# EAGLE design RelayTest (EAGLE 9.0.1)
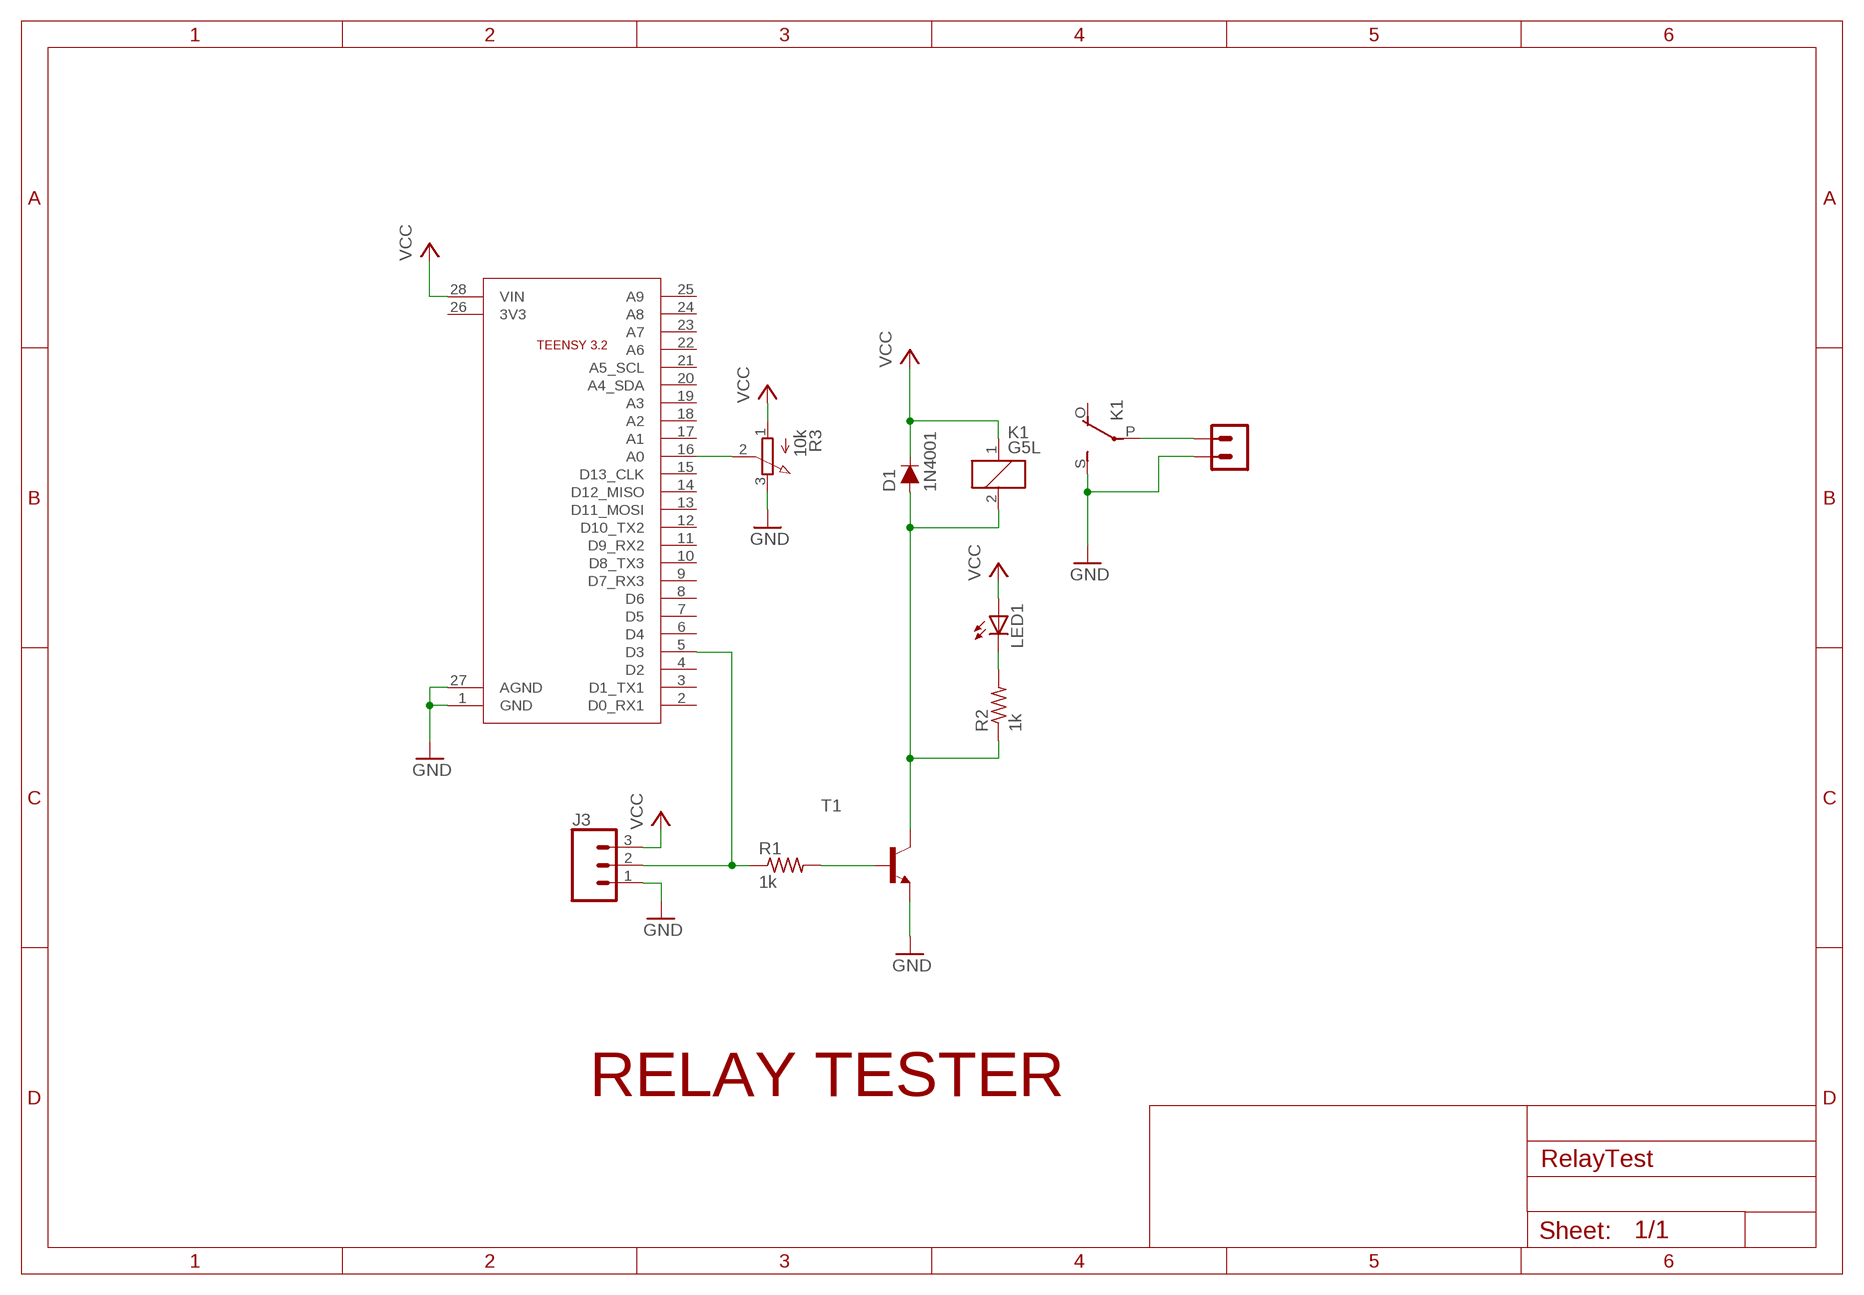
[diagram p0: schematic, sheet 1]

## Parts
D1  1N4001  DIODE-KIT2  [DIODE-1N4001-KIT]
J3  CONN_03SCREW  [SCREWTERMINAL-3.5MM-3]
K1  G5L  [G5LE]
LED1  LED3MM  [LED3MM]
R1  1k  R-US_0204/7  [0204/7]
R2  1k  R-US_0204/7  [0204/7]
R3  10k  3RP/1610N  [3RP/1610N]
T1  -NPN-TO92-EBC  [TO92-EBC]
U$1  TEENSY3.2  [TEENSY]
U$2  BIG_TERMINAL_2PINBIG  [BIG_TERMINAL_2PIN]

## Nets
GND: J3.1 K1.S(2:S) R3.3(E) T1.E U$1.1(GND) U$1.27(AGND) U$2.P$2
N$1: LED1.K(C) R2.2
N$2: R1.2 T1.B
N$3: J3.2 R1.1 U$1.5(D3)
N$4: R3.2(S) U$1.16(A0)
N$7: D1.A K1.2 R2.1 T1.C
N$10: K1.P(2:P) U$2.P$1
VCC: D1.C J3.3 K1.1 LED1.A R3.1(A) U$1.28(VIN)
Unconnected: K1.O(2:O) U$1.2(D0_RX1) U$1.3(D1_TX1) U$1.4(D2) U$1.6(D4) U$1.7(D5) U$1.8(D6) U$1.9(D7_RX3) U$1.10(D8_TX3) U$1.11(D9_RX2) U$1.12(D10_TX2) U$1.13(D11_MOSI) U$1.14(D12_MISO) U$1.15(D13_CLK) U$1.17(A1) U$1.18(A2) U$1.19(A3) U$1.20(A4_SDA) U$1.21(A5_SCL) U$1.22(A6) U$1.23(A7) U$1.24(A8) U$1.25(A9) U$1.26(3V3)

## Notes on the sheet
- RELAY TESTER

## Library data of the parts
D1 = SparkFun-DiscreteSemi:DIODE: Diode These are standard reverse protection diodes and small signal diodes. SparkFun Products: SparkFun SparkPunk Sound Kit <https://www.sparkfun.com/products/11177> SparkFun ESP8266 Thing <https://www.sparkfun.com/products/13231>; PROD_ID: DIO-09176; VALUE: 1A/50V/1.1V
J3 = SparkFun-Connectors:CONN_03: Multi connection point. Often used as Generic Header-pin footprint for 0.1 inch spaced/style header connections On any of the 0.1 inch spaced packages, you can populate with these: Break Away Headers - Straight <https://www.sparkfun.com/products/116> (PRT-00116) Break Away Male Headers - Right Angle <https://www.sparkfun.com/products/553> (PRT-00553) Female Headers <https://www.sparkfun.com/products/115> (PRT-00115) Break Away Headers - Machine Pin <https://www.sparkfun.com/products/117> (PRT-00117) Break Away Female Headers - Swiss Machine Pin <https://www.sparkfun.com/products/743> (PRT-00743) Stackable Header - 3 Pin (Female, 0.1") <https://www.sparkfun.com/products/13875> (PRT-13875) For SCREWTERMINALS and SPRING TERMINALS visit here: Screw Terimnals on SparkFun.com <https://www.sparkfun.com/search/results?term=Screw+Terminals> (5mm/3.5mm/2.54mm spacing) This device is also useful as a general connection point to wire up your design to another part of your project. Our various solder wires solder well into these plated through hole pads. Hook-Up Wire - Assortment (Stranded, 22 AWG) <https://www.sparkfun.com/products/11375> (PRT-11375) Hook-Up Wire - Assortment (Solid Core, 22 AWG) <https://www.sparkfun.com/products/11367> (PRT-11367) View the entire wire category on our website here <https://www.sparkfun.com/categories/141> Special notes: Molex polarized connector foot print use with SKU : PRT-08232 with associated crimp pins and housings.; PROD_ID: CONN-08288; SF_ID: PRT-08235
K1 = relay:G5L: RELAY 1 x switch, 10 A/120 V AC, 8 A/30 V ADC, Omron; OC_FARNELL: unknown; OC_NEWARK: unknown
LED1 = adafruit:LED: LED OSRAM: - CHIPLED LG R971, LG N971, LY N971, LG Q971, LY Q971, LO R971, LY R971 LH N974, LH R974 LS Q976, LO Q976, LY Q976 LO Q996 - Hyper CHIPLED LW Q18S LB Q993, LB Q99A, LB R99A - SideLED LS A670, LO A670, LY A670, LG A670, LP A670 LB A673, LV A673, LT A673, LW A673 LH A674 LY A675 LS A676, LA A676, LO A676, LY A676, LW A676 LS A679, LY A679, LG A679 - Hyper Micro SIDELED® LS Y876, LA Y876, LO Y876, LY Y876 LT Y87S - SmartLED LW L88C, LW L88S LB L89C, LB L89S, LG L890 LS L89K, LO L89K, LY L89K LS L896, LA L896, LO L896, LY L896 - TOPLED LS T670, LO T670, LY T670, LG T670, LP T670 LSG T670, LSP T670, LSY T670, LOP T670, LYG T670 LG T671, LOG T671, LSG T671 LB T673, LV T673, LT T673, LW T673 LH T674 LS T676, LA T676, LO T676, LY T676, LB T676, LH T676, LSB T676, LW T676 LB T67C, LV T67C, LT T67C, LS T67K, LO T67K, LY T67K, LW E67C LS E67B, LA E67B, LO E67B, LY E67B, LB E67C, LV E67C, LT E67C LW T67C LS T679, LY T679, LG T679 LS T770, LO T770, LY T770, LG T770, LP T770 LB T773, LV T773, LT T773, LW T773 LH T774 LS E675, LA E675, LY E675, LS T675 LS T776, LA T776, LO T776, LY T776, LB T776 LHGB T686 LT T68C, LB T68C - Hyper Mini TOPLED® LB M676 - Mini TOPLED Santana® LG M470 LS M47K, LO M47K, LY M47K Source: http://www.osram.convergy.de/
R1 R2 = rcl:R-US_: RESISTOR, American symbol; SPICEPREFIX: R
R3 = pot:3RP/1610N: 16mm Potentiometer one level Source: http://www.alphapotentiometers.net/html/16mm_pot_2.html
T1 = DC_LOAD_AU:*-NPN-: NPN Transistror BF959 corrected 2008.03.06
U$1 = EzerLonginus:TEENSY
U$2 = EzerLonginus:BIG_TERMINAL_2PIN

## Board
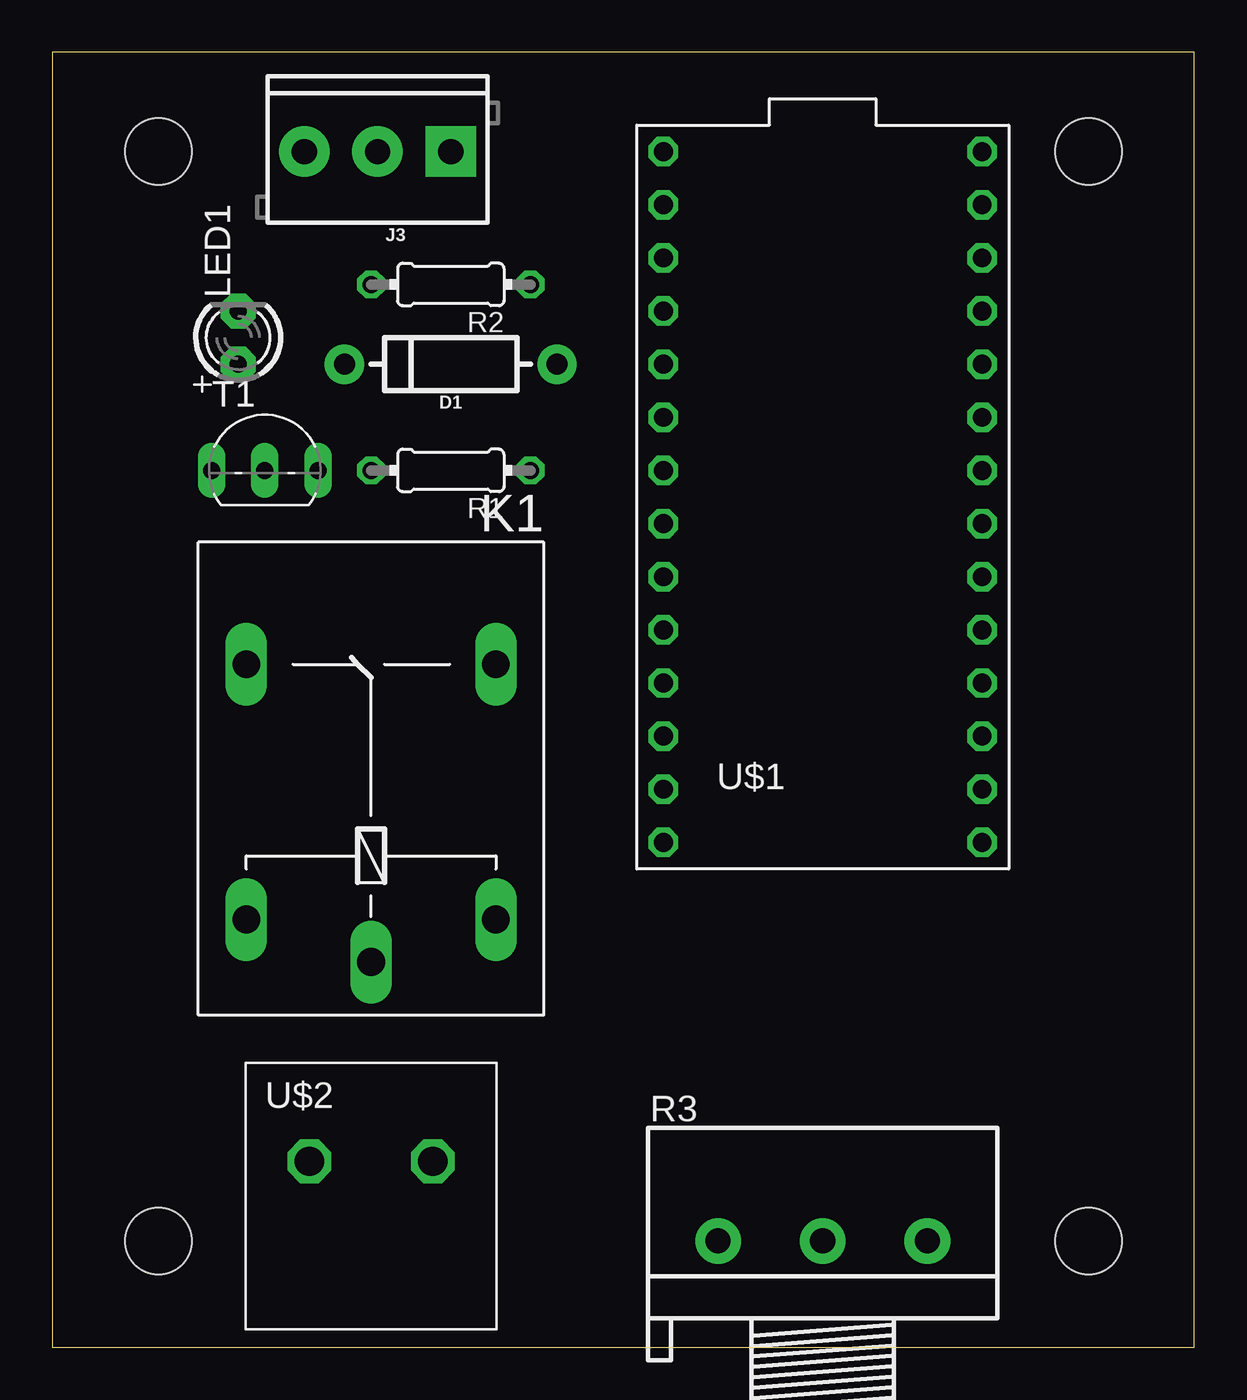
[diagram p1: board, top side]
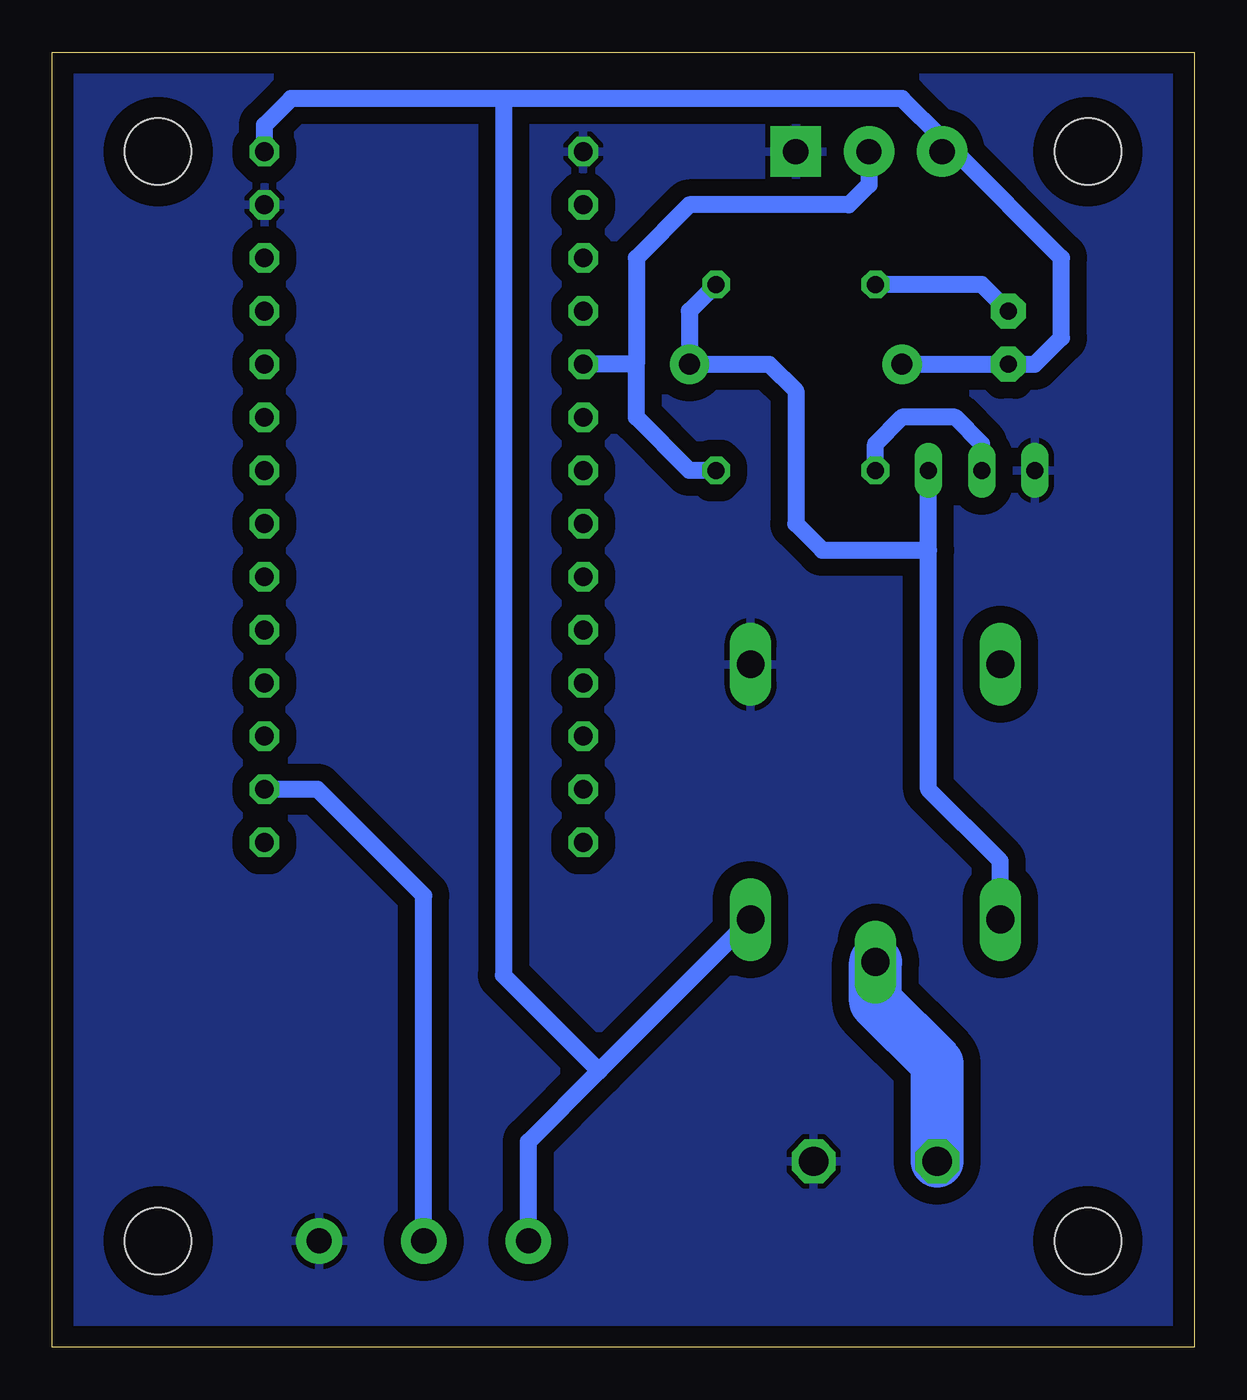
[diagram p2: board, bottom side, seen from below]

Size 54.59 x 61.9 mm. Coordinates in mm from the lower left corner, seen from the top.
Outline: 0,0 54.59,0 54.59,61.9 0,61.9 0,0
Copper layers (1*16): Top 0.035mm / dielectric 1.5mm / Bottom 0.035mm
Design rules "default": minimum track width 6mil, minimum drill 0.35mm, track to track 6mil, track to pad 6mil, pad to pad 6mil, via to via 6mil, smd to smd 6mil, copper to edge 40mil, drill to drill 6mil, minimum pad ring 10mil, minimum via ring 8mil, stop-mask expansion 4mil, vias tented up to drill 0mil, thermal gap 10mil
Holes 3.17 mm at 5.08,57.15 5.08,5.08 49.53,5.08 49.53,57.15

### Footprints (pad centres in the part's own frame; a part is rotated, then mirrored left to right if it is on the bottom)
DIODE-1N4001-KIT = drill 1.016 pad 1.88: A -5.08,0; C 5.08,0
SCREWTERMINAL-3.5MM-3 = drill 1.2 pad 2.413 square: 1 0,0 | drill 1.2 pad 2.413: 2 3.5,0; 3 7,0
G5LE = drill 1.321 long: 1 -7.493,-5.969; 2 -7.493,5.969; O 4.699,5.969; P -9.525,0; S 4.699,-5.969
LED3MM = drill 0.813 pad 1.676 octagon: A -1.27,0; K 1.27,0
0204/7 = drill 0.813 octagon: 1 -3.81,0; 2 3.81,0
3RP/1610N = drill 1.2 pad 2.184: 1 -5,0; 2 0,0; 3 5,0
TO92-EBC = drill 0.813 long: B 0,-1.27; C 2.54,-1.27; E -2.54,-1.27
TEENSY = drill 0.9 octagon: 1 -7.62,17.78; 2 -7.62,15.24; 3 -7.62,12.7; 4 -7.62,10.16; 5 -7.62,7.62; 6 -7.62,5.08; 7 -7.62,2.54; 8 -7.62,0; 9 -7.62,-2.54; 10 -7.62,-5.08; 11 -7.62,-7.62; 12 -7.62,-10.16; 13 -7.62,-12.7; 14 -7.62,-15.24; 15 7.62,-15.24; 16 7.62,-12.7; 17 7.62,-10.16; 18 7.62,-7.62; 19 7.62,-5.08; 20 7.62,-2.54; 21 7.62,0; 22 7.62,2.54; 23 7.62,5.08; 24 7.62,7.62; 25 7.62,10.16; 26 7.62,12.7; 27 7.62,15.24; 28 7.62,17.78
BIG_TERMINAL_2PIN = drill 1.397 octagon: P$1 -2.953,0; P$2 2.953,0

### Placement (x,y rotation side)
D1  19.05,46.99 180 top
J3  19.05,57.15 180 top
K1  15.24,27.94 90 top
LED1  8.89,48.26 90 top
R1  19.05,41.91 180 top
R2  19.05,50.8 180 top
R3  36.83,5.08 0 top
T1  10.16,43.18 0 top
U$1  36.83,39.37 0 top
U$2  15.24,8.89 0 top

### Tracks (layer width: path | path; a pad name or v marks a point on that pad's centre or on a via)
GND
  pour Bottom (isolate 0.813): 0,62.23 0,0 54.61,0 54.61,62.23
N$1
  Bottom 0.813: LED1.K 10.16,50.8 R2.2
N$2
  Bottom 0.813: R1.2 15.24,43.18 13.97,44.45 11.43,44.45 10.16,43.18 T1.B
N$3
  Bottom 0.813: R1.1 24.13,41.91 26.67,44.45 26.67,46.99 | 26.67,46.99 U$1.5 | J3.2 15.55,55.57 16.51,54.61 24.13,54.61 26.67,52.07 26.67,46.99
N$4
  Bottom 0.813: R3.2 36.83,21.59 41.91,26.67 U$1.16
N$7
  Bottom 0.813: R2.1 24.13,49.53 D1.A 20.32,46.99 19.05,45.72 19.05,39.37 17.78,38.1 12.7,38.1 | 12.7,38.1 12.7,26.67 9.27,23.24 K1.2 | 12.7,38.1 T1.C
N$10
  Bottom 2.54: K1.P 15.24,16.51 12.29,13.56 U$2.P$1
VCC
  Bottom 0.813: D1.C LED1.A 7.62,46.99 6.35,48.26 6.35,52.07 11.43,57.15 J3.3 12.05,57.77 13.97,59.69 33.02,59.69 | 33.02,59.69 43.18,59.69 44.45,58.42 U$1.28 | R3.1 31.83,9.83 28.45,13.21 | 28.45,13.21 K1.1 | 33.02,59.69 33.02,17.78 28.45,13.21